# EAGLE design IRRX (EAGLE 6.5.0)
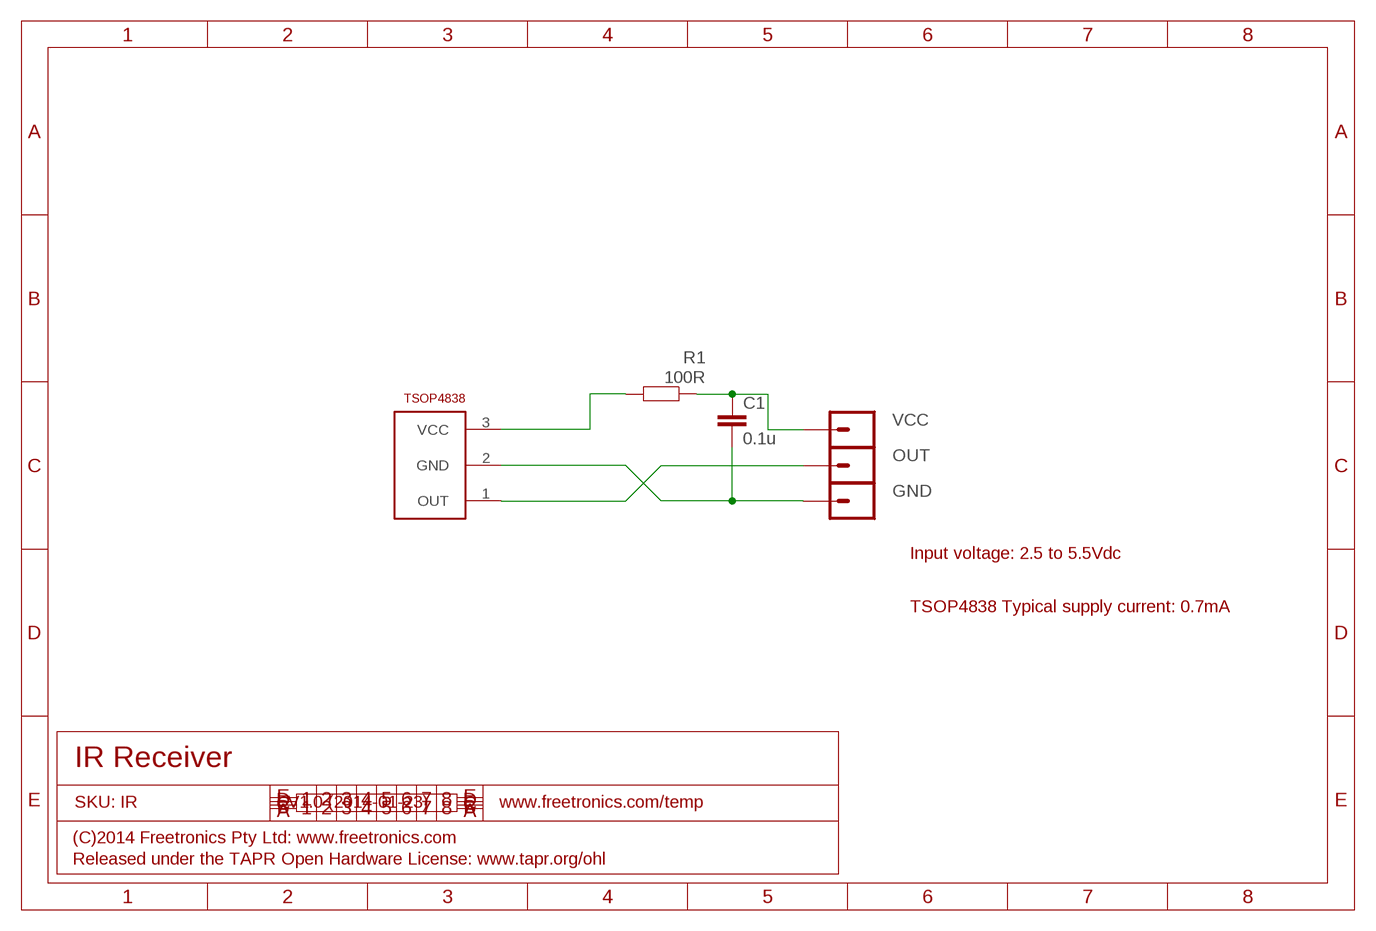
[diagram p0: schematic, sheet 1]

## Parts
C1  0.1u  CAP0603  [0603]
GND  M01PTH  [1X01]
OUT  M01PTH  [1X01]
R1  100R  RESISTOR0603  [0603]
TSOP4838  TSOP4838  [TO220]
VCC  M01PTH  [1X01]

## Nets
GND: C1.2 GND.1 TSOP4838.2(GND)
N$1: OUT.1 TSOP4838.1(OUT)
N$2: R1.2 TSOP4838.3(VCC)
N$4: C1.1 R1.1 VCC.1

## Notes on the sheet
- Input voltage: 2.5 to 5.5Vdc
- TSOP4838 Typical supply current: 0.7mA
- IR Receiver
- SKU: IR | V1.0 (2014-01-23) | www.freetronics.com/temp
- (C)2014 Freetronics Pty Ltd: www.freetronics.com
- Released under the TAPR Open Hardware License: www.tapr.org/ohl

## Library data of the parts
C1 = freetronics-original:CAP: Capacitor Standard 0603 ceramic capacitor, and 0.1" leaded capacitor.
GND OUT VCC = freetronics-master-v1:M01: Header 1 Standard 1-pin 0.1" header. Use with straight break away headers (SKU : PRT-00116), right angle break away headers (PRT-00553), swiss pins (PRT-00743), machine pins (PRT-00117), and female headers (PRT-00115).
R1 = freetronics-master-v1:RESISTOR: Resistor Basic schematic elements and footprints for 0603, 1206, and PTH 1/10th watt (small) resistors.
TSOP4838 = freetronics-original:TSOP4838

## Board
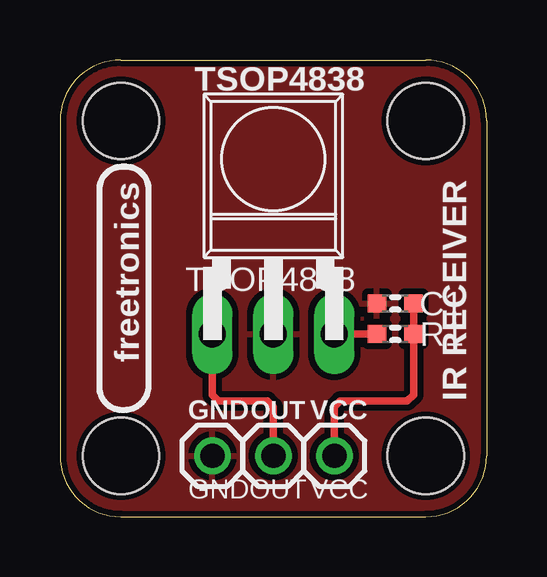
[diagram p1: board, top side]
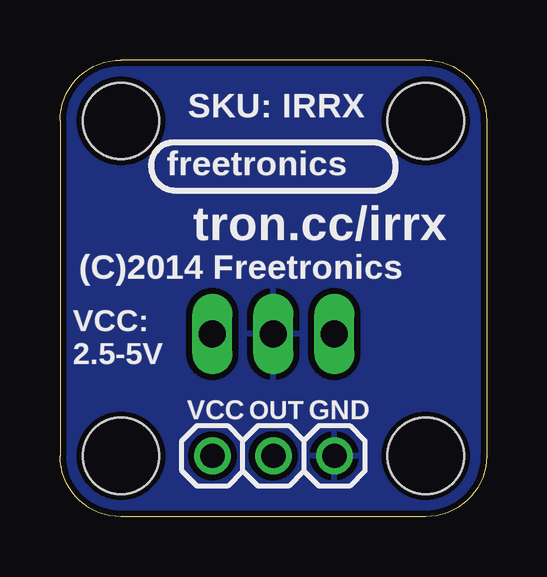
[diagram p2: board, bottom side, seen from below]

Size 17.78 x 19.05 mm. Coordinates in mm from the lower left corner, seen from the top.
Outline: 0,2.54 arc90 2.54,0 15.24,0 arc90 17.78,2.54 17.78,16.51 arc90 15.24,19.05 2.54,19.05 arc90 0,16.51 0,2.54
Copper layers (1*16): Top 0.035mm / dielectric 1.5mm / Bottom 0.035mm
Design rules "default *": minimum track width 8mil, minimum drill 15mil, track to track 10mil, track to pad 10mil, pad to pad 10mil, via to via 10mil, smd to smd 8mil, copper to edge 10mil, drill to drill 8mil, minimum pad ring 10mil, minimum via ring 8mil, stop-mask expansion 4mil, vias tented up to drill 25mil, thermal gap 10mil
Holes 3.17 mm at 2.54,2.54 15.24,2.54 2.54,16.51 15.24,16.51

### Footprints (pad centres in the part's own frame; a part is rotated, then mirrored left to right if it is on the bottom)
0603 = smd 0.762 x 0.762: 1 -0.762,0; 2 0.762,0
1X01 = drill 1.016: 1 0,0
TO220 = drill 1.118 long: 1 -2.54,0; 2 0,0; 3 2.54,0

### Placement (x,y rotation side)
C1  13.97,8.89 180 top
GND  6.35,2.54 0 top
OUT  8.89,2.54 0 top
R1  13.97,7.62 180 top
TSOP4838  8.89,7.62 0 top
VCC  11.43,2.54 0 top

### Tracks (layer width: path | path; a pad name or v marks a point on that pad's centre or on a via)
GND
  pour Bottom: 2.54,19.05 arc90 0,16.51 0,2.54 arc90 2.54,0 15.24,0 arc90 17.78,2.54 17.78,16.51 arc90 15.24,19.05
  pour Top: 0,16.51 0,2.54 arc90 2.54,0 15.24,0 arc90 17.78,2.54 17.78,16.51 arc90 15.24,19.05 2.54,19.05 arc90
N$1
  Top 0.305: TSOP4838.1 6.35,5.08 6.6,4.83 8.64,4.83 8.89,4.57 OUT.1
N$2
  Top 0.305: TSOP4838.3 R1.2
N$4
  Top 0.305: R1.1 C1.1 14.73,5.08 14.48,4.83 11.68,4.83 11.43,4.57 VCC.1

### Text on the board
tPlace: TSOP4838 | freetronics | IR RECEIVER | GND | OUT | VCC
bPlace: SKU: IRRX | freetronics | tron.cc/irrx | (C)2014 Freetronics | VCC: / 2.5-5V | GND | OUT | VCC